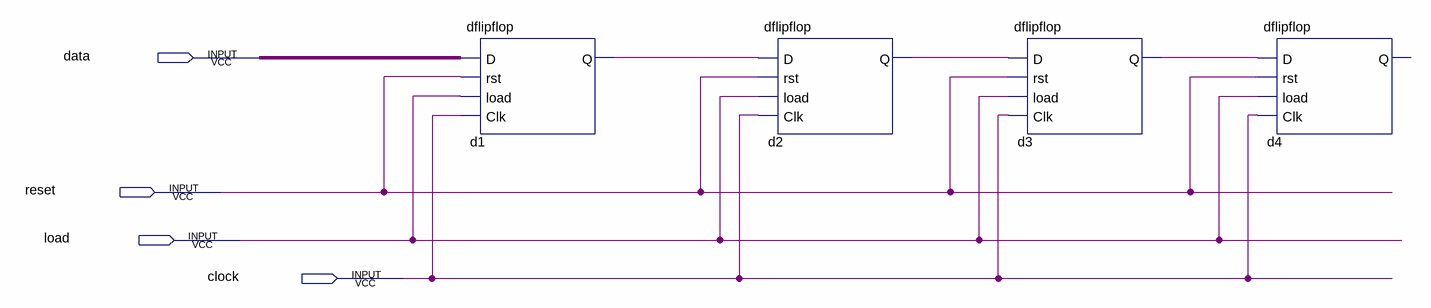
[diagram p0: schematic sheet]
// Quartus schematic shiftreg.bdf as structural Verilog: 4 symbols, 4 pins
module shiftreg (
  input  data,
  input  reset,
  input  load,
  input  clock
);

  wire d1_q, d2_q, d3_q;

  dflipflop d1 (.D(data), .rst(reset), .load(load), .Clk(clock), .Q(d1_q));
  dflipflop d2 (.D(d1_q), .rst(reset), .load(load), .Clk(clock), .Q(d2_q));
  dflipflop d3 (.D(d2_q), .rst(reset), .load(load), .Clk(clock), .Q(d3_q));
  dflipflop d4 (.D(d3_q), .rst(reset), .load(load), .Clk(clock));  // open: Q
endmodule
